# EasyEDA schematic SCH_RE2-AY-3-8910 v0.2a_2024-01-09.json

## Sheets
1 PSG: TITLE: Sheet_1; REV: 1.0; Date: 2023-12-22; Sheet: 1/1; Drawn By: Denjhang; Company: Your Company
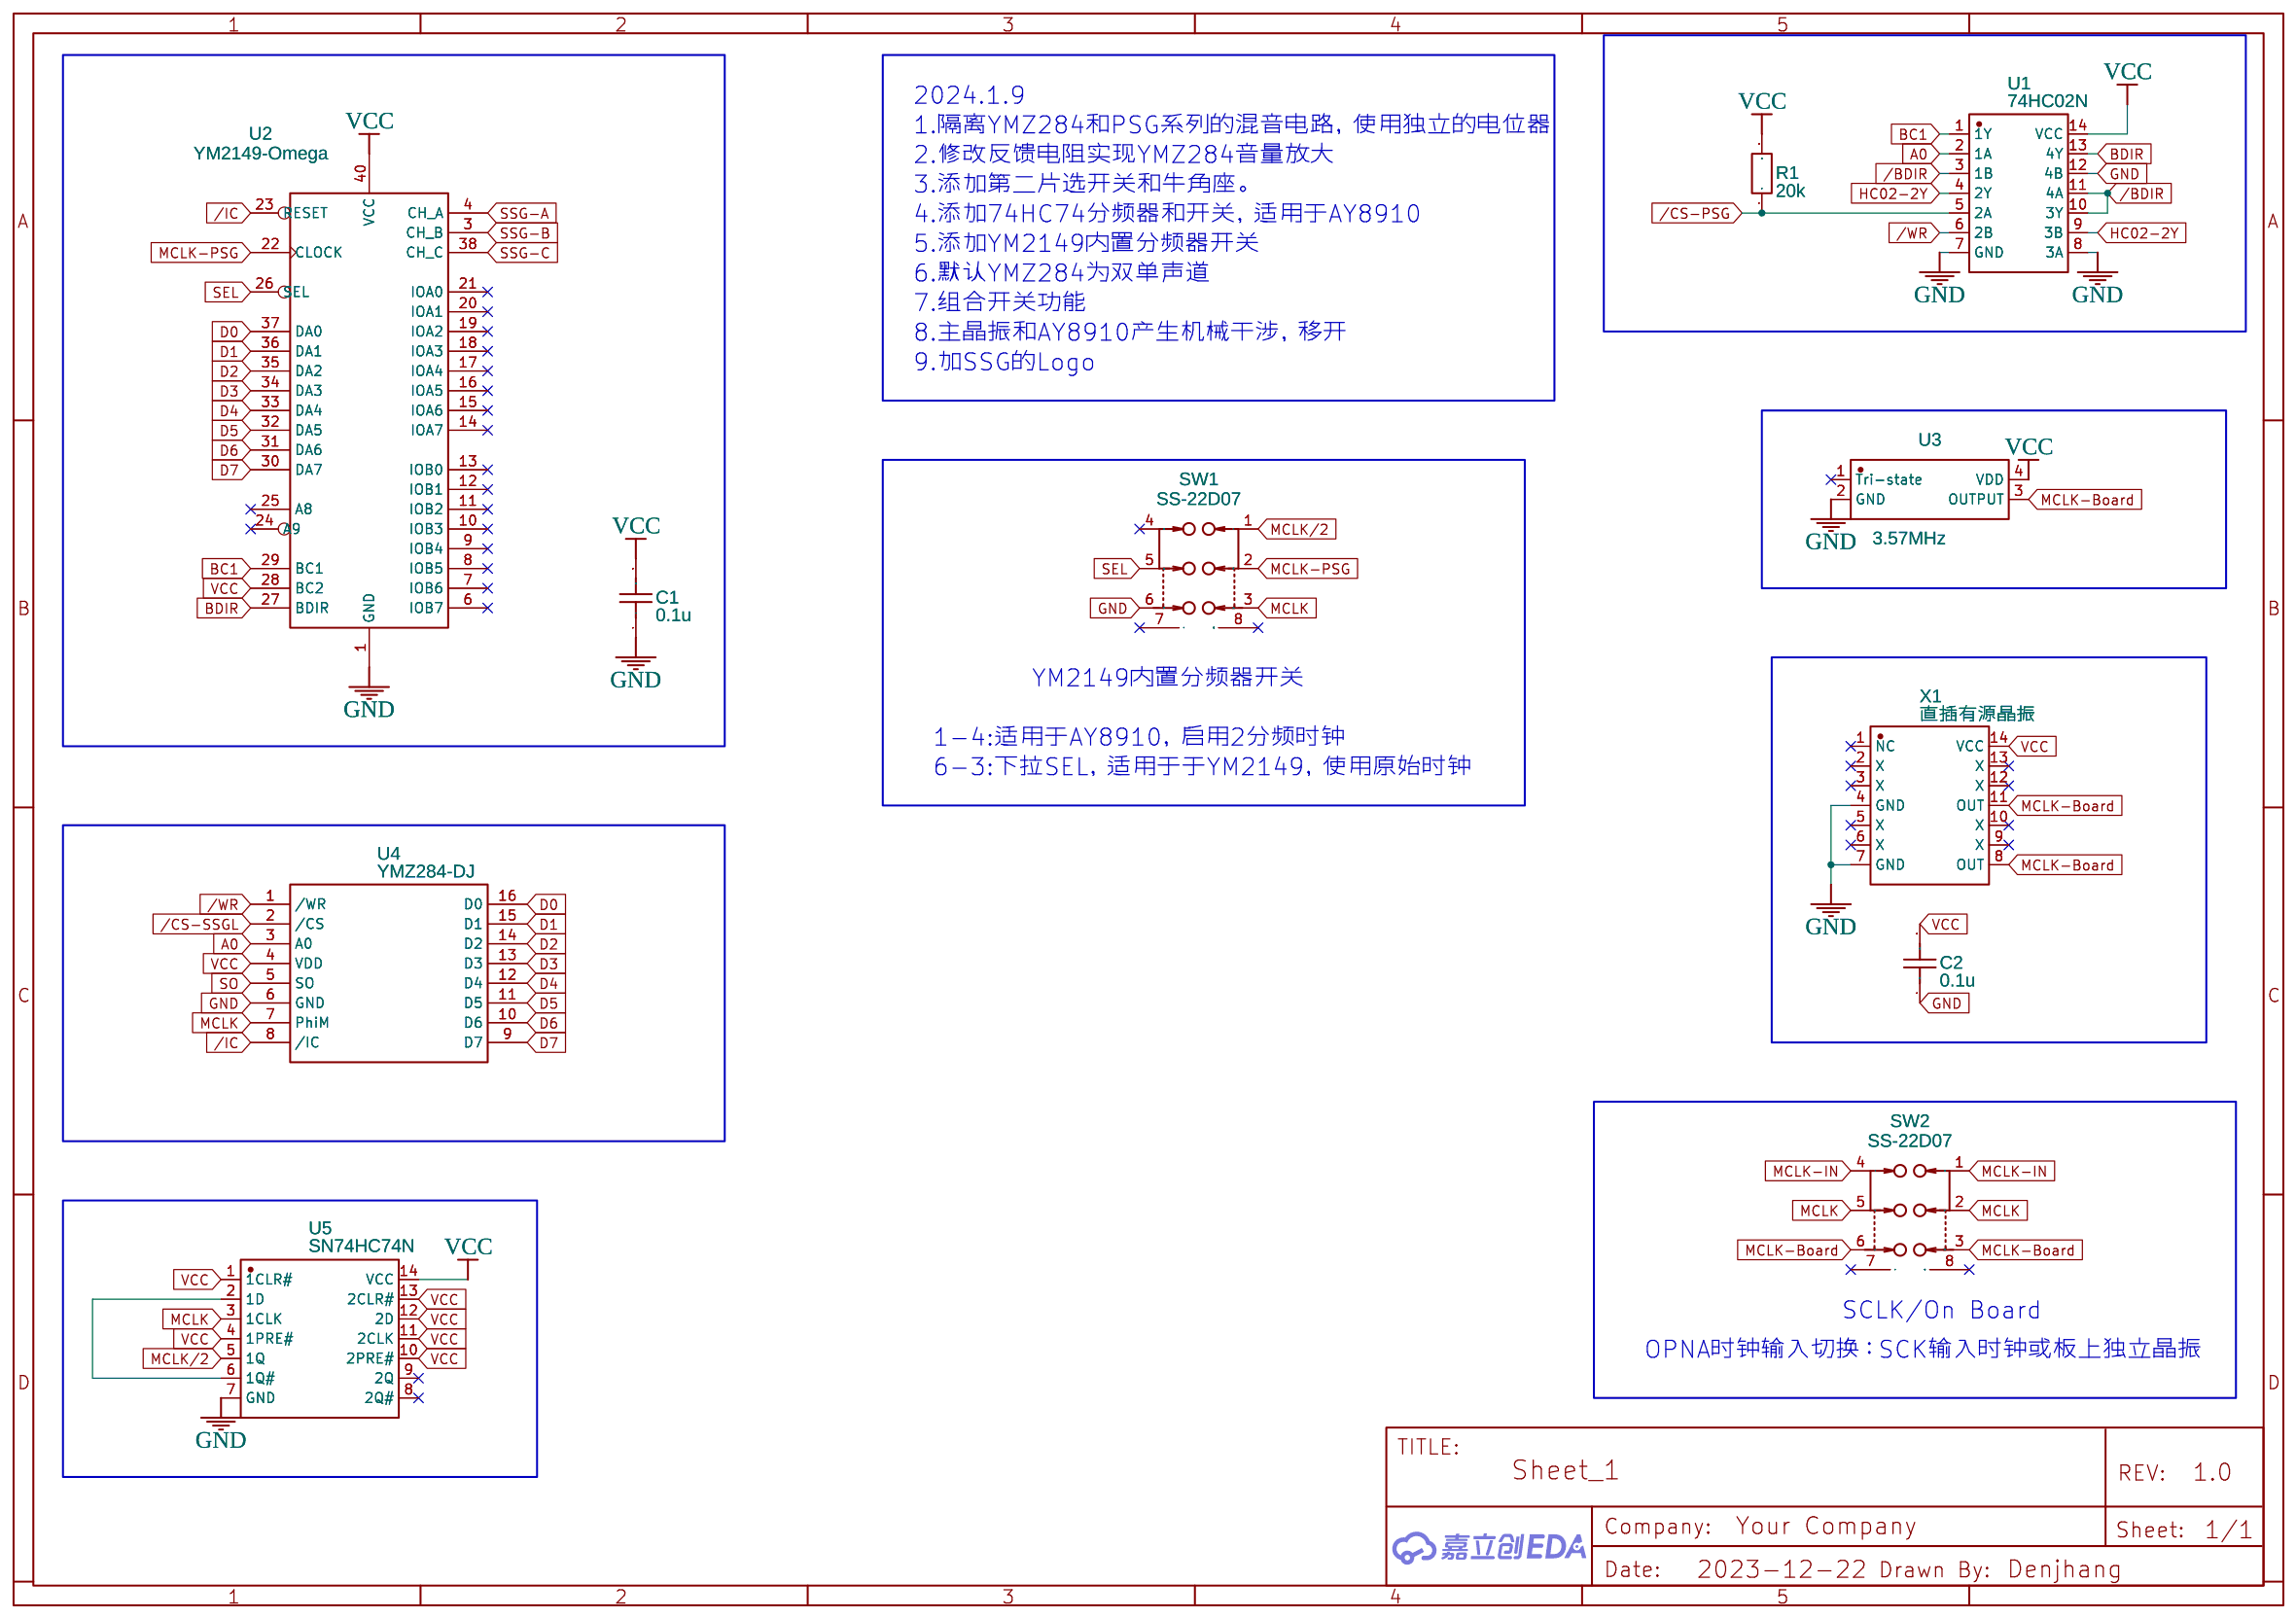
[diagram p0: PSG]
2 Stereo: Date: 2023-12-23
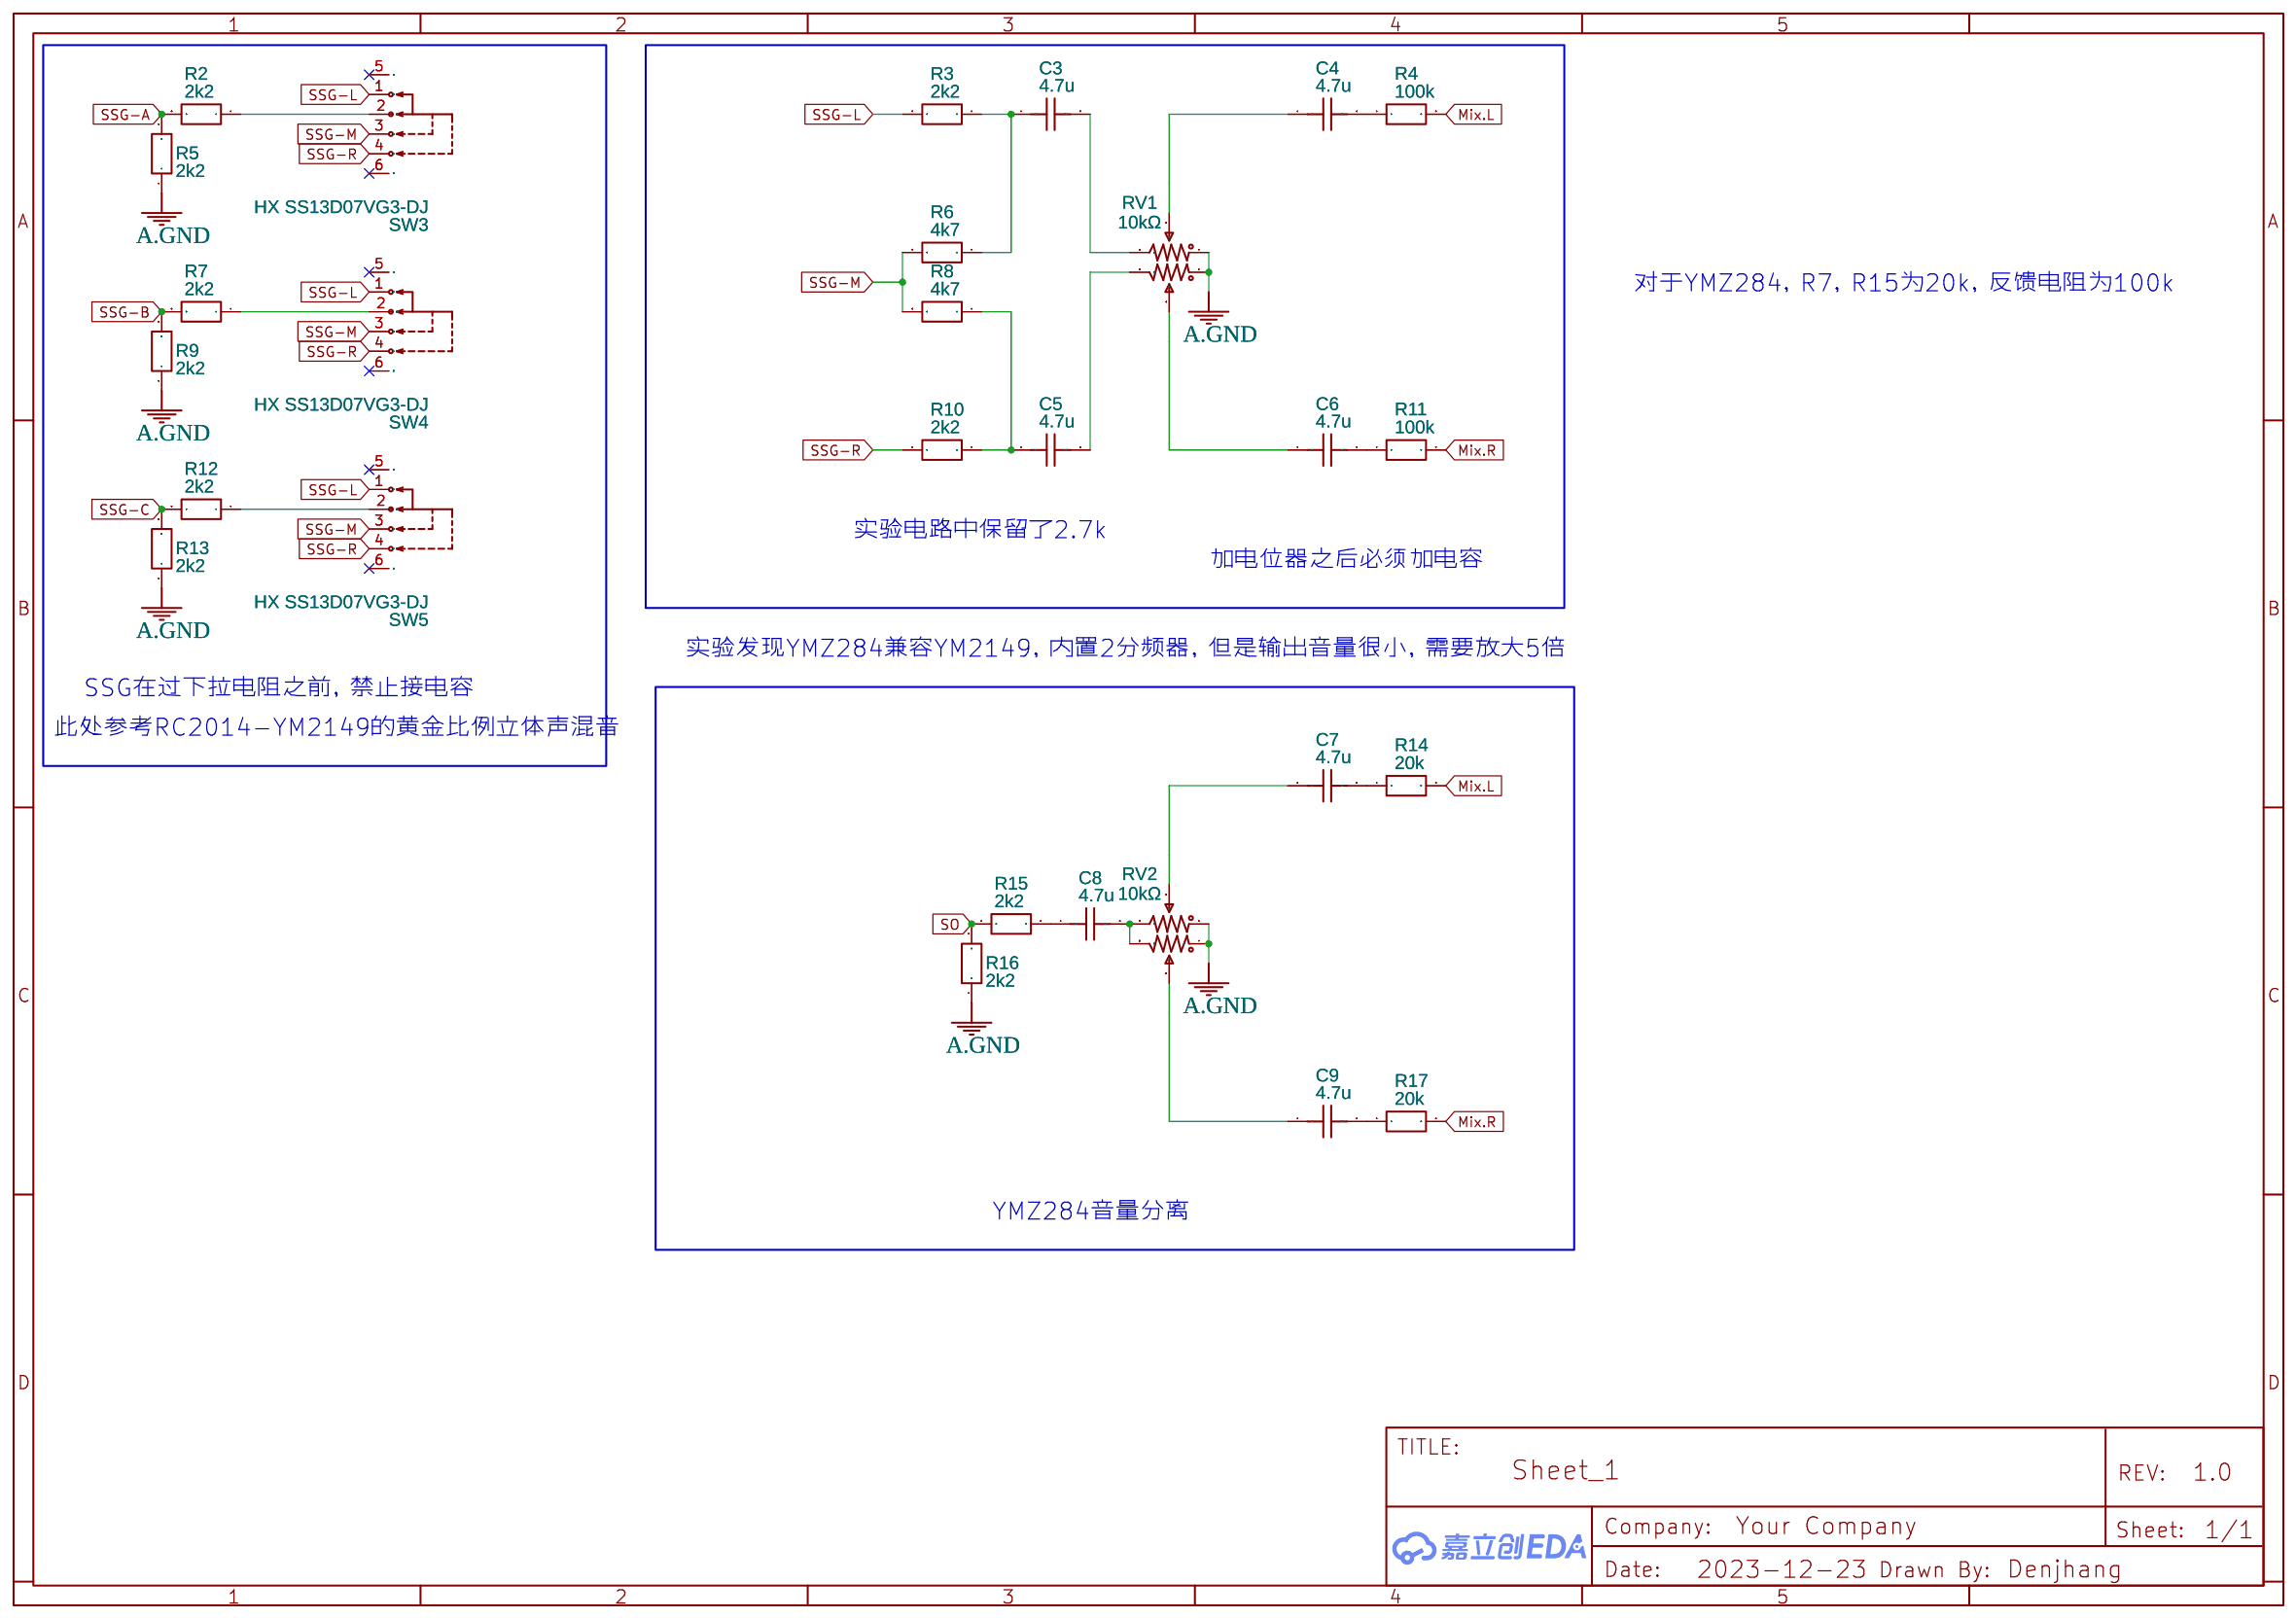
[diagram p1: Stereo]
3 BUS: Date: 2023-12-23
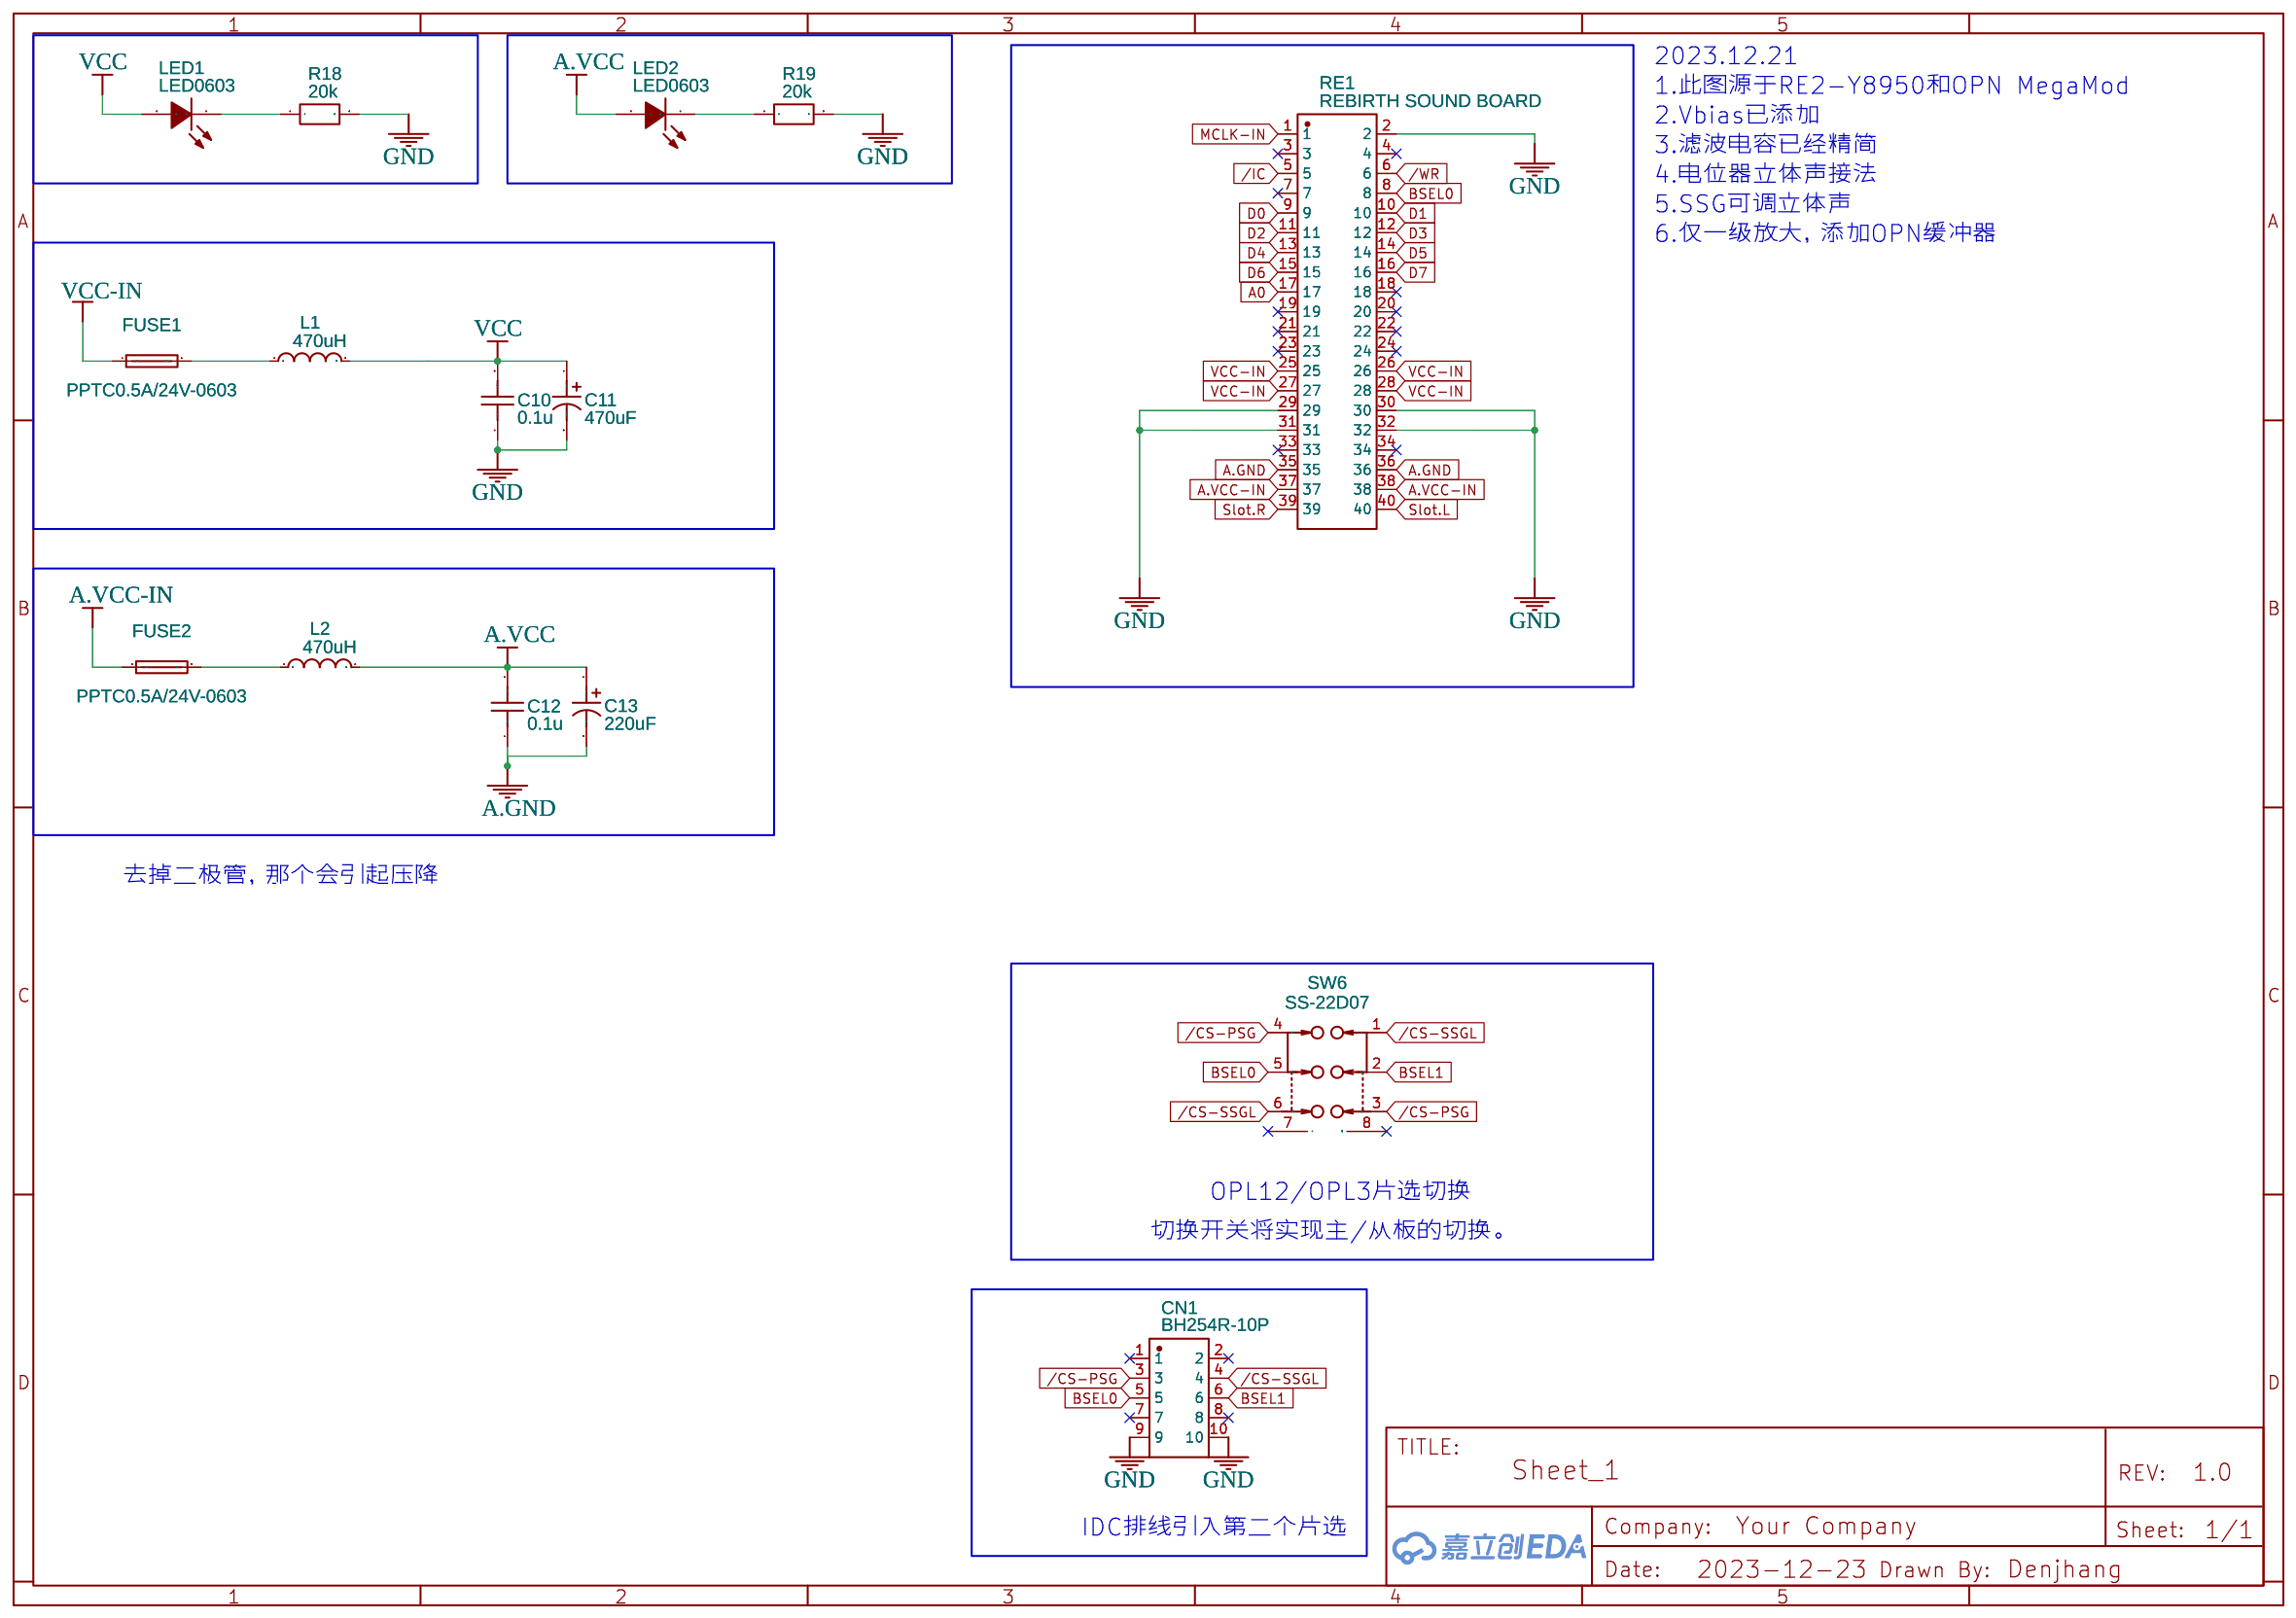
[diagram p2: BUS]
4 Mixer: Date: 2023-12-23
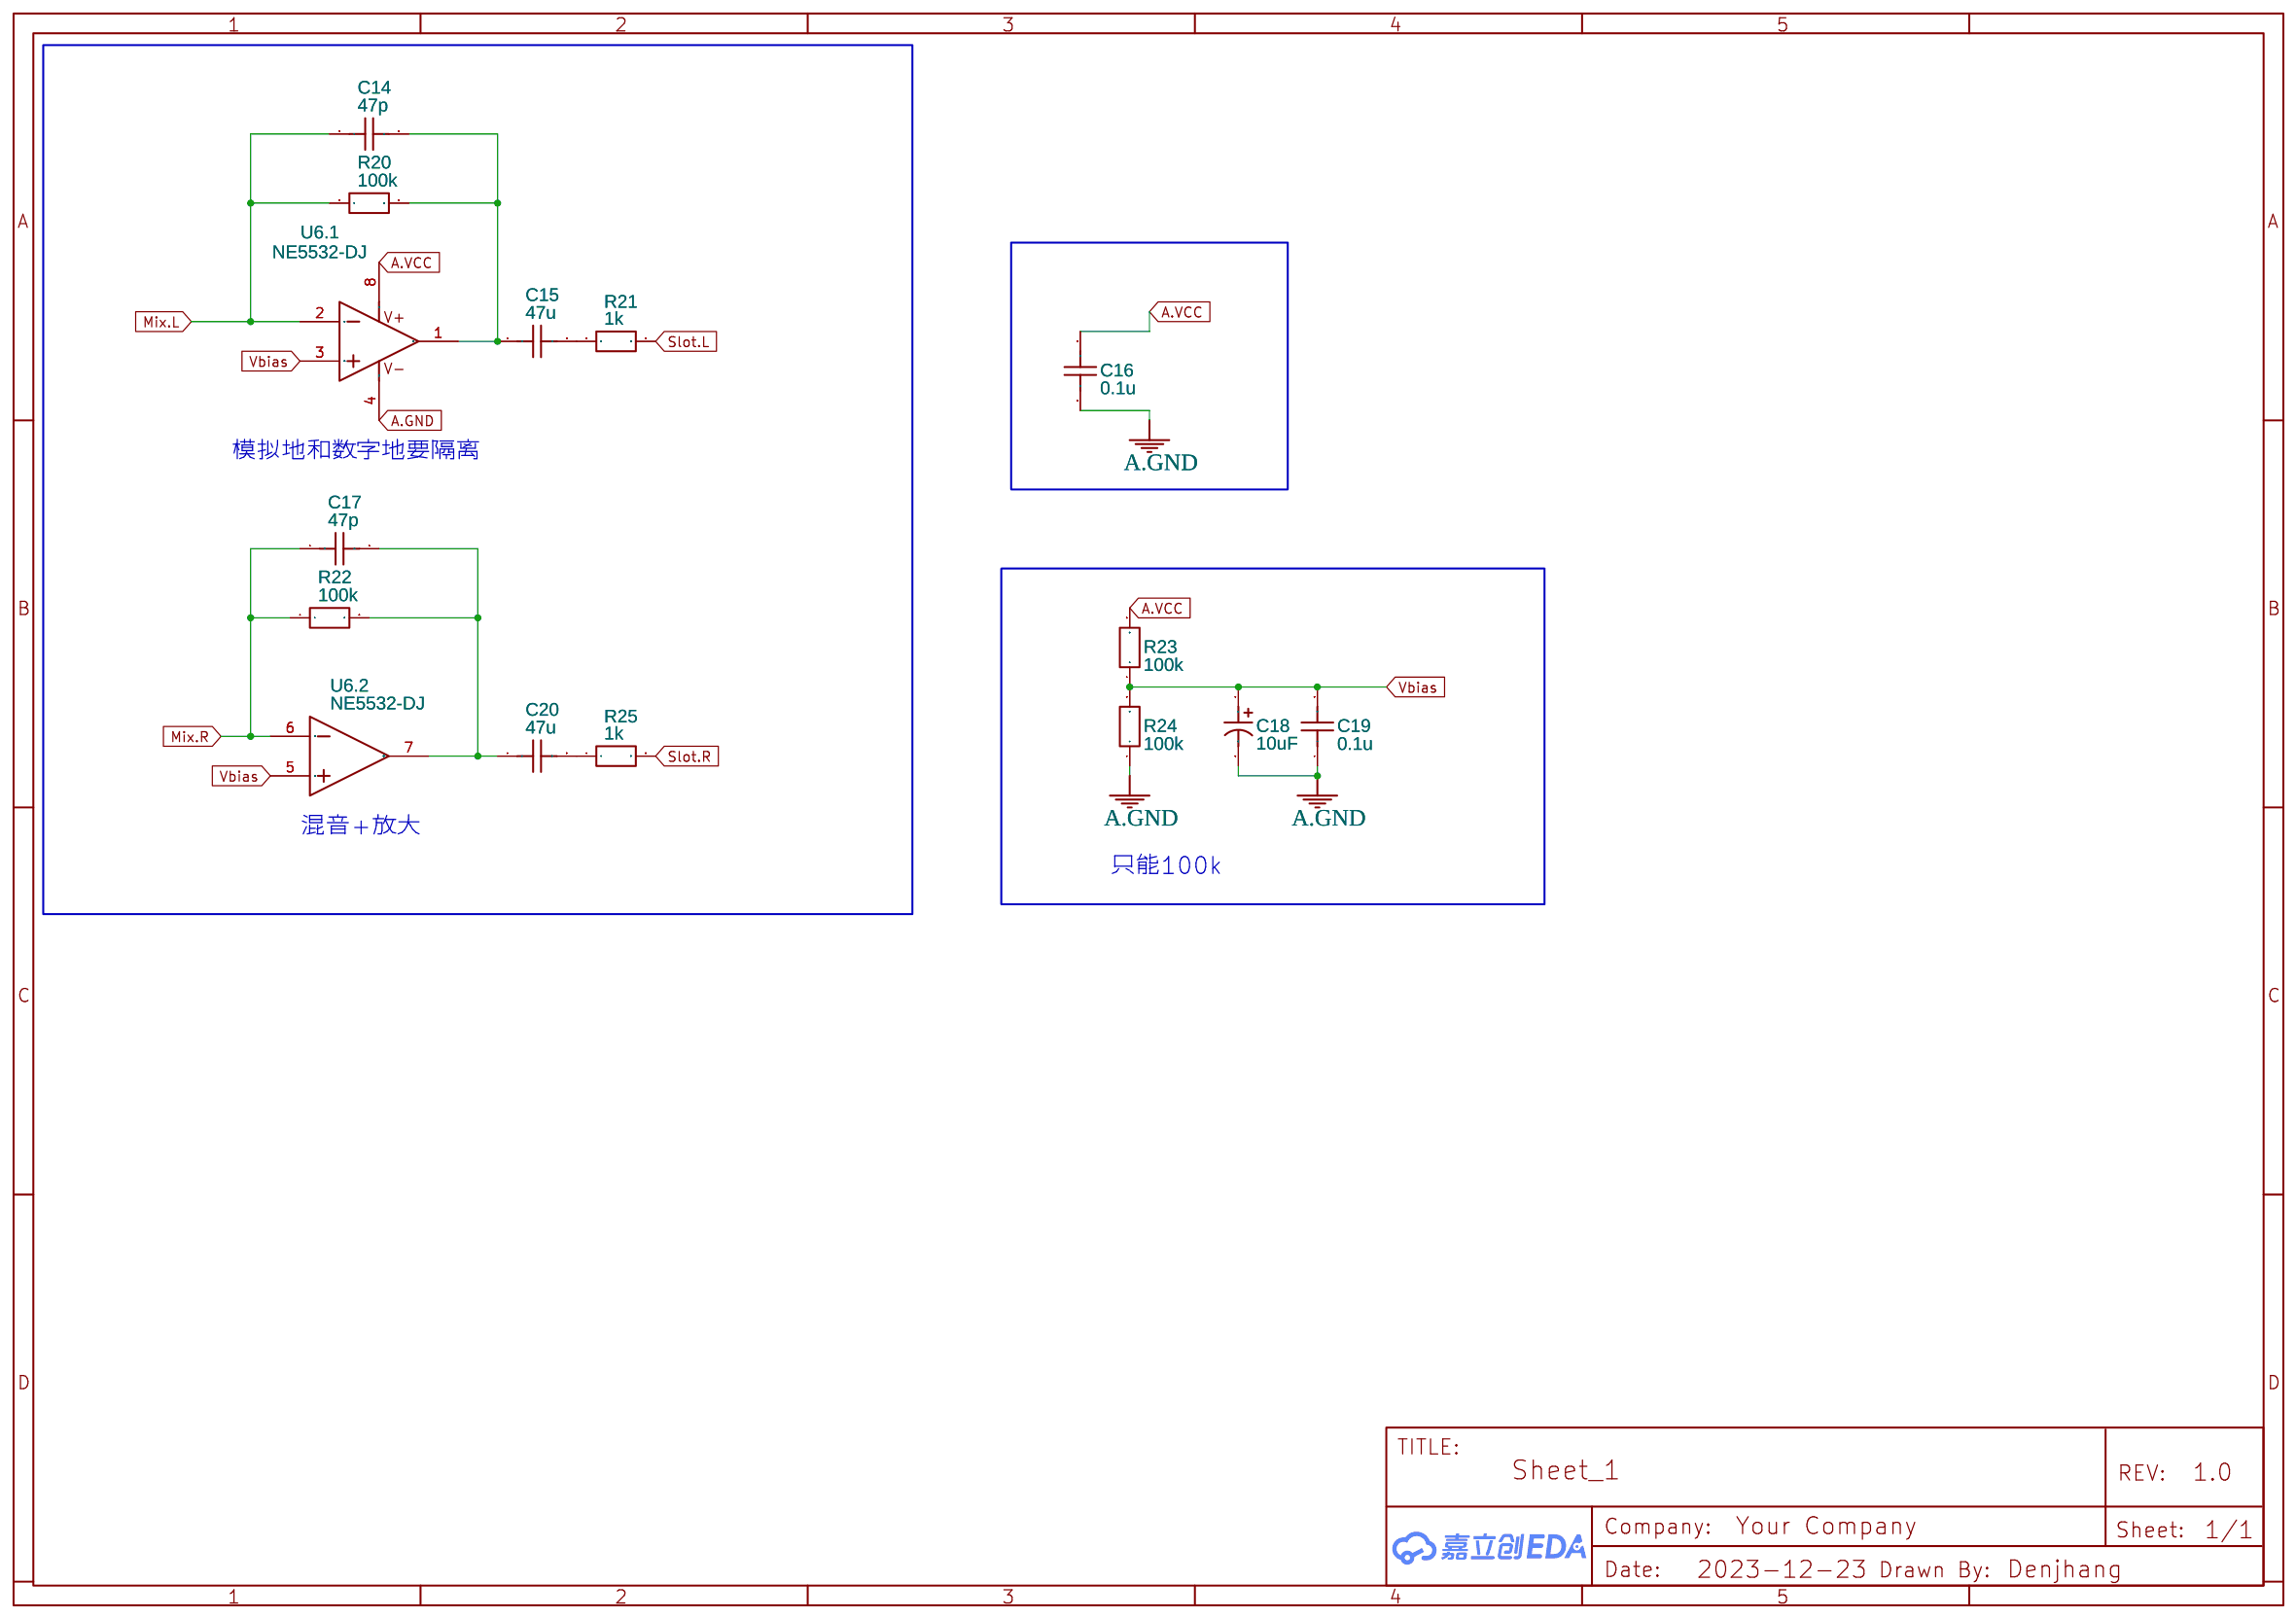
[diagram p3: Mixer]

## Parts
sheet BUS
C10  0.1u  [C0603]
C11  470uF  [CAP-SMD_BD6.3-L6.6-W6.6-FD]
C12  0.1u  [C0603]
C13  220uF  [CAP-SMD_BD6.3-L6.6-W6.6-LS7.2-FD]
CN1  BH254R-10P  [IDC-TH_10P-P2.54-H-R2-C5-S2.54]
FUSE1  PPTC0.5A/24V-0603  [F0603]
FUSE2  PPTC0.5A/24V-0603  [F0603]
L1  470uH  [IND-SMD_L5.8-W5.2]
L2  470uH  [IND-SMD_L5.8-W5.2]
LED1  LED0603  [LED0603-RD]
LED2  LED0603  [LED0603-RD]
R18  20k  [R0603]
R19  20k  [R0603]
RE1  REBIRTH SOUND BOARD  [REBIRTH SOUND BOARD]
SW6  SS-22D07  [SW-TH_SS-22D07]
sheet Mixer
C14  47p  [C0603]
C15  47u  [C0805]
C16  0.1u  [C0603]
C17  47p  [C0603]
C18  10uF  [CAP-SMD_BD5.0-L5.3-W5.3-LS6.0-FD]
C19  0.1u  [C0603]
C20  47u  [C0805]
R20  100k  [R0603]
R21  1k  [R0603]
R22  100k  [R0603]
R23  100k  [R0603]
R24  100k  [R0603]
R25  1k  [R0603]
U6  NE5532-DJ  [DIP-8-DJ]  (sections 1,2)
sheet PSG
C1  0.1u  [C0603]
C2  0.1u  [C0603]
R1  20k  [R0603]
SW1  SS-22D07  [SW-TH_SS-22D07]
SW2  SS-22D07  [SW-TH_SS-22D07]
U1  74HC02N  [DIP-14_L19.6-W6.4-P2.54-LS7.6-BL]
U2  YM2149-Omega  [DIP40-DJ]
U3  3.57MHz  [OSC-SMD_4P-L3.2-W2.5-BL]
U4  YMZ284-DJ  [DIP16-DJ]
U5  SN74HC74N  [PDIP-14_L19.3-W6.4-P2.54-LS7.6-BL]
X1  直插有源晶振  [DIP14-有源晶振]
sheet Stereo
C3  4.7u  [C0603]
C4  4.7u  [C0603]
C5  4.7u  [C0603]
C6  4.7u  [C0603]
C7  4.7u  [C0603]
C8  4.7u  [C0603]
C9  4.7u  [C0603]
R2  2k2  [R0603]
R3  2k2  [R0603]
R4  100k  [R0603]
R5  2k2  [R0603]
R6  4k7  [R0603]
R7  2k2  [R0603]
R8  4k7  [R0603]
R9  2k2  [R0603]
R10  2k2  [R0603]
R11  100k  [R0603]
R12  2k2  [R0603]
R13  2k2  [R0603]
R14  20k  [R0603]
R15  2k2  [R0603]
R16  2k2  [R0603]
R17  20k  [R0603]
RV1  10kΩ  [RK097G-DJ]
RV2  10kΩ  [RK097G-DJ]
SW3  HX SS13D07VG3-DJ  [SW-TH_SS13D07VG4]
SW4  HX SS13D07VG3-DJ  [SW-TH_SS13D07VG4]
SW5  HX SS13D07VG3-DJ  [SW-TH_SS13D07VG4]

## Library data of the parts
C1-C10 C12 C14 C16 C17 C19 = C_0603_US: Contributor: LCEDA_Lib
C11 = RVT220UF16V67RV0015: Contributor: LCSC; Supplier: LCSC; Supplier Part: C2887273; Manufacturer: KNSCHA(科尼盛); JLCPCB Part Class: Extended Part; link: https://so.szlcsc.com/global.html?k=C2887273&ref=editor
C13 = RVT47UF35V67RV0039: Contributor: LCSC; Supplier: LCSC; Supplier Part: C2836440; Manufacturer: KNSCHA(科尼盛); JLCPCB Part Class: Extended Part; link: https://so.szlcsc.com/global.html?k=C2836440&ref=editor
CN1 = BH254R-10P: Contributor: LCSC; Supplier: LCSC; Supplier Part: C492448; Manufacturer: XFCN(兴飞); JLCPCB Part Class: Extended Part; link: https://so.szlcsc.com/global.html?k=C492448&ref=editor
FUSE1 FUSE2 = PPTC0.5A/24V-0603: Contributor: LCSC; Supplier: LCSC; Supplier Part: C9900007586; Manufacturer: null; Manufacturer Part: PPTC0.5A/24V 自恢复保险丝-0603; JLCPCB Part Class: Extended Part
L1 L2 = MSCD54-471KT: Contributor: LCSC; Supplier: LCSC; Supplier Part: C915206; Manufacturer: Meled(美莱); JLCPCB Part Class: Extended Part; link: https://so.szlcsc.com/global.html?k=C915206&ref=editor
LED1 LED2 = LED0603: Supplier: LCSC; Supplier Part: C2892154; Manufacturer: GBG; Manufacturer Part: GBG-C192KRKT; link: https://atta.szlcsc.comnull; Contributor: Denjhang
R1-R25 = R_0603_EU: Contributor: LCEDA_Lib
RE1 = REBIRTH SOUND BOARD: Contributor: lcsc; Supplier: LCSC; Supplier Part: C5242133; Manufacturer: XKB Connectivity(中国星坤); Manufacturer Part: X6522WR-2x20H-C60D30-E43F03
SW1 SW2 SW6 = SS-22D07: Supplier Part: C34982; Supplier: LCSC; Manufacturer: ReliaPro; JLCPCB Part Class: Extended Part; link: https://so.szlcsc.com/global.html?k=C34982&ref=editor
C15 C20 = C_0805_US: Contributor: LCEDA_Lib
C18 = RVT100UF10V67RV0036: Contributor: LCSC; Supplier: LCSC; Supplier Part: C2891567; Manufacturer: KNSCHA(科尼盛); JLCPCB Part Class: Extended Part; link: https://so.szlcsc.com/global.html?k=C2891567&ref=editor
U6 = NE5532-DJ: tags: Audio Operational Amplifier; Supplier Part: C5326; Supplier: LCSC; Manufacturer: TI; Manufacturer Part: NE5532P; subpart_no: 1; image: http://image.lceda.cn/szlcsc/C5326.jpg; JLCPCB Part Class: Extended Part; Contributor: Denjhang
U1 = 74HC02N: Contributor: LCSC; Supplier: LCSC; Supplier Part: C507193; Manufacturer: HGSEMI(华冠); link: https://so.szlcsc.com/global.html?k=C507193&ref=editor
U2 = YM2149-Omega: Contributor: denjhang
U3 = OT32254MJBA4SL: Contributor: lcsc; Supplier: LCSC; Supplier Part: C2831397; Manufacturer: YXC(扬兴晶振); JLCPCB Part Class: Extended Part; link: https://so.szlcsc.com/global.html?k=C2831397&ref=editor
U4 = YMZ284-DJ: Contributor: Denjhang
U5 = SN74HC74N: JLCPCB Part Class: Extended Part; Supplier: LCSC; Manufacturer: TI(德州仪器); Supplier Part: C2895; link: https://so.szlcsc.com/global.html?k=C2895&ref=editor
X1 = 直插有源晶振: Contributor: denjhang
RV1 RV2 = RK097-双连体: Contributor: LCSC; Supplier: LCSC; Supplier Part: C231763; Manufacturer: ALPSALPINE(阿尔卑斯阿尔派); Manufacturer Part: RK09712200MY; JLCPCB Part Class: Extended Part
SW3-SW5 = HX SS13D07VG3-DJ: Supplier: LCSC; Supplier Part: C5149830; Manufacturer: hanxia(韩下); Manufacturer Part: HX SS13D07VG3; link: https://atta.szlcsc.com/upload/public/pdf/source/20220907/D3055C4464BFAA66BEB4549CABC5DD1D.pdf; Contributor: Denjhang

## Nets
GND: C1.1 C2.1 C10.1 C11.2 CN1.9 CN1.10 R18.2 R19.2 RE1.2 RE1.29 RE1.30 RE1.31 RE1.32 SW1.6 U1.7(GND) U1.8(3A) U1.12(4B) U2.1(GND) U3.2(GND) U4.6(GND) U5.7(GND) X1.4(GND) X1.7(GND)
VCC: C1.2 C2.2 C10.2 C11.1 L1.2 LED1.2(A) R1.2 U1.14(VCC) U2.28(BC2) U2.40(VCC) U3.4(VDD) U4.4(VDD) U5.1(1CLR#) U5.4(1PRE#) U5.10(2PRE#) U5.11(2CLK) U5.12(2D) U5.13(2CLR#) U5.14(VCC) X1.14(VCC)
VCC-IN: FUSE1.1 RE1.25 RE1.26 RE1.27 RE1.28
/BDIR: U1.3(1B) U1.10(3Y) U1.11(4A)
/CS-PSG: CN1.3 R1.1 SW6.3 SW6.4 U1.5(2A)
/CS-SSGL: CN1.4 SW6.1 SW6.6 U4.2(/CS)
/IC: RE1.5 U2.23(RESET) U4.8(/IC)
/WR: RE1.6 U1.6(2B) U4.1(/WR)
A0: RE1.17 U1.2(1A) U4.3(A0)
A.GND: C12.1 C13.2 C16.1 C18.2 C19.1 R5.1 R9.1 R13.1 R16.1 R24.1 RE1.35 RE1.36 RV1.1 RV1.4 RV2.1 RV2.4 U6.4(VCC-)
A.VCC: C12.2 C13.1 C16.2 L2.2 LED2.2(A) R23.2 U6.8(VCC+)
A.VCC-IN: FUSE2.1 RE1.37 RE1.38
BC1: U1.1(1Y) U2.29(BC1)
BDIR: U1.13(4Y) U2.27(BDIR)
BSEL0: CN1.5 RE1.8 SW6.5
BSEL1: CN1.6 SW6.2
D0: RE1.9 U2.37(DA0) U4.16(D0)
D1: RE1.10 U2.36(DA1) U4.15(D1)
D2: RE1.11 U2.35(DA2) U4.14(D2)
D3: RE1.12 U2.34(DA3) U4.13(D3)
D4: RE1.13 U2.33(DA4) U4.12(D4)
D5: RE1.14 U2.32(DA5) U4.11(D5)
D6: RE1.15 U2.31(DA6) U4.10(D6)
D7: RE1.16 U2.30(DA7) U4.9(D7)
HC02-2Y: U1.4(2Y) U1.9(3B)
MCLK: SW1.3 SW2.2 SW2.5 U4.7(PhiM) U5.3(1CLK)
MCLK-Board: SW2.3 SW2.6 U3.3(OUTPUT) X1.8(OUT) X1.11(OUT)
MCLK-IN: RE1.1 SW2.1 SW2.4
MCLK-PSG: SW1.2 U2.22(CLOCK)
MCLK/2: SW1.1 U5.5(1Q)
Mix.L: C14.1 R4.2 R14.2 R20.1 U6.2(IN1-)
Mix.R: C17.1 R11.2 R17.2 R22.1 U6.6(IN2-)
SEL: SW1.5 U2.26(SEL)
Slot.L: R21.2 RE1.40
Slot.R: R25.2 RE1.39
SO: R15.2 R16.2 U4.5(SO)
SSG-A: R2.2 R5.2 U2.4(CH_A)
SSG-B: R7.2 R9.2 U2.3(CH_B)
SSG-C: R12.2 R13.2 U2.38(CH_C)
SSG-L: R3.2 SW3.1 SW4.1 SW5.1
SSG-M: R6.2 R8.2 SW3.3 SW4.3 SW5.3
SSG-R: R10.2 SW3.4 SW4.4 SW5.4
Vbias: C18.1 C19.2 R23.1 R24.2 U6.3(IN1+) U6.5(IN2+)
Net-(C3-1): C3.1 R3.1 R6.1
Net-(C3-2): C3.2 RV1.3
Net-(C4-1): C4.1 RV1.2
Net-(C4-2): C4.2 R4.1
Net-(C5-1): C5.1 R8.1 R10.1
Net-(C5-2): C5.2 RV1.6
Net-(C6-1): C6.1 RV1.5
Net-(C6-2): C6.2 R11.1
Net-(C7-1): C7.1 RV2.2
Net-(C7-2): C7.2 R14.1
Net-(C8-1): C8.1 R15.1
Net-(C8-2): C8.2 RV2.3 RV2.6
Net-(C9-1): C9.1 RV2.5
Net-(C9-2): C9.2 R17.1
Net-(C14-2): C14.2 C15.1 R20.2 U6.1(OUT1)
Net-(C15-2): C15.2 R21.1
Net-(C17-2): C17.2 C20.1 R22.2 U6.7(OUT2)
Net-(C20-2): C20.2 R25.1
Net-(FUSE1-2): FUSE1.2 L1.1
Net-(FUSE2-2): FUSE2.2 L2.1
Net-(LED1-1): LED1.1(C) R18.1
Net-(LED2-1): LED2.1(C) R19.1
Net-(R2-1): R2.1 SW3.2
Net-(R7-1): R7.1 SW4.2
Net-(R12-1): R12.1 SW5.2
Net-(U5-2): U5.2(1D) U5.6(1Q#)

Not connected (* = marked no-connect by the designer): CN1 1* 2* 7* 8*; RE1 3* 4* 7* 18* 19* 20* 21* 22* 23* 24* 33* 34*; SW1 4* 7* 8*; SW2 7* 8*; SW3 5* 6*; SW4 5* 6*; SW5 5* 6*; SW6 7* 8*; U2 6(IOB7)* 7(IOB6)* 8(IOB5)* 9(IOB4)* 10(IOB3)* 11(IOB2)* 12(IOB1)* 13(IOB0)* 14(IOA7)* 15(IOA6)* 16(IOA5)* 17(IOA4)* 18(IOA3)* 19(IOA2)* 20(IOA1)* 21(IOA0)* 24(A9)* 25(A8)*; U3 1(Tri-state)*; U5 8(2Q#)* 9(2Q)*; X1 1(NC)* 2(X)* 3(X)* 5(X)* 6(X)* 9(X)* 10(X)* 12(X)* 13(X)*

## Notes on the sheets
sheet 1
- 2024.1.9
- 1.隔离YMZ284和PSG系列的混音电路，使用独立的电位器
- 2.修改反馈电阻实现YMZ284音量放大
- 3.添加第二片选开关和牛角座。
- 4.添加74HC74分频器和开关，适用于AY8910
- 5.添加YM2149内置分频器开关
- 6.默认YMZ284为双单声道
- 7.组合开关功能
- 8.主晶振和AY8910产生机械干涉，移开
- 9.加SSG的Logo
- YM2149内置分频器开关
- 1-4:适用于AY8910，启用2分频时钟
- 6-3:下拉SEL，适用于于YM2149，使用原始时钟
- SCLK/On Board
- OPNA时钟输入切换：SCK输入时钟或板上独立晶振
sheet 2
- 对于YMZ284，R7，R15为20k，反馈电阻为100k
- 实验电路中保留了2.7k
- 加电位器之后必须加电容
- 实验发现YMZ284兼容YM2149，内置2分频器，但是输出音量很小，需要放大5倍
- SSG在过下拉电阻之前，禁止接电容
- 此处参考RC2014-YM2149的黄金比例立体声混音
- YMZ284音量分离
sheet 3
- 2023.12.21
- 1.此图源于RE2-Y8950和OPN MegaMod
- 2.Vbias已添加
- 3.滤波电容已经精简
- 4.电位器立体声接法
- 5.SSG可调立体声
- 6.仅一级放大，添加OPN缓冲器
- 去掉二极管，那个会引起压降
- OPL12/OPL3片选切换
- 切换开关将实现主/从板的切换。
- IDC排线引入第二个片选
sheet 4
- 模拟地和数字地要隔离
- 混音+放大
- 只能100k
